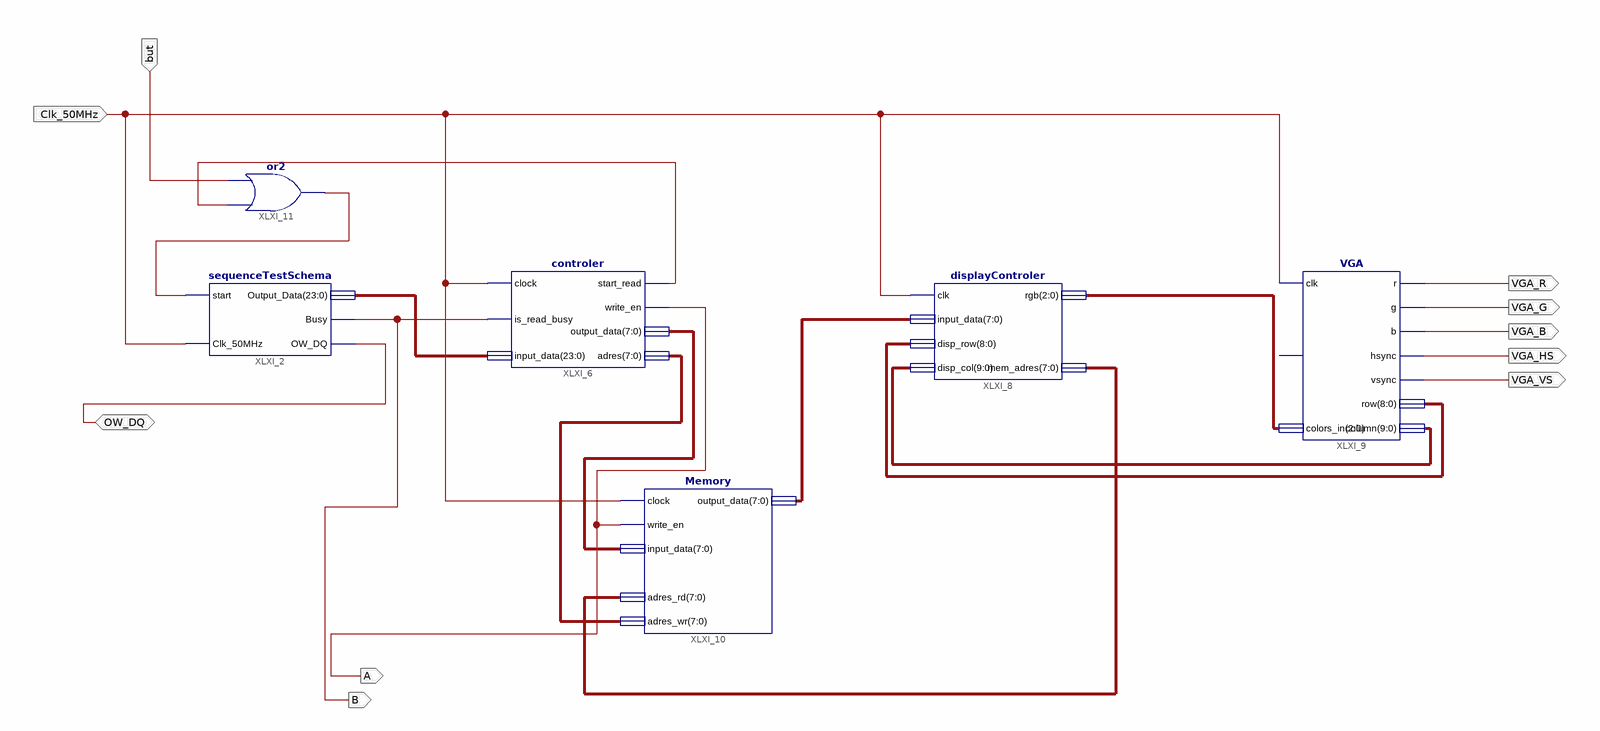
[diagram p0: schematic sheet 1]
// Xilinx ISE schematic temperatureSystem.sch (spartan3e) as structural Verilog: 6 symbols, 10 ports
module temperatureSystem (
  input  Clk_50MHz,
  input  but,
  inout  OW_DQ,
  output VGA_VS,
  output VGA_HS,
  output VGA_B,
  output VGA_G,
  output VGA_R,
  output A,
  output B
);

  wire XLXN_2, XLXN_19;
  wire [2:0] XLXN_7;
  wire [7:0] XLXN_4, XLXN_8, XLXN_14, XLXN_15;
  wire [8:0] XLXN_6;
  wire [9:0] XLXN_5;
  wire [23:0] XLXN_13;

  sequenceTestSchema XLXI_2 (.start(XLXN_2), .Clk_50MHz(Clk_50MHz), .Output_Data(XLXN_13), .Busy(B), .OW_DQ(OW_DQ));
  controler XLXI_6 (
    .clock(Clk_50MHz), .is_read_busy(B), .input_data(XLXN_13), .start_read(XLXN_19), .write_en(A),
    .output_data(XLXN_4), .adres(XLXN_14));
  displayControler XLXI_8 (
    .clk(Clk_50MHz), .input_data(XLXN_8), .disp_row(XLXN_6), .disp_col(XLXN_5), .rgb(XLXN_7),
    .mem_adres(XLXN_15));
  VGA XLXI_9 (
    .clk(Clk_50MHz), .colors_in(XLXN_7), .r(VGA_R), .g(VGA_G), .b(VGA_B), .hsync(VGA_HS), .vsync(VGA_VS),
    .row(XLXN_6), .column(XLXN_5));  // open: reset
  Memory XLXI_10 (
    .clock(Clk_50MHz), .write_en(A), .input_data(XLXN_4), .adres_rd(XLXN_15), .adres_wr(XLXN_14),
    .output_data(XLXN_8));
  or XLXI_11 (XLXN_2, XLXN_19, but);
endmodule
